# EAGLE design v11 (EAGLE 9.3.0)
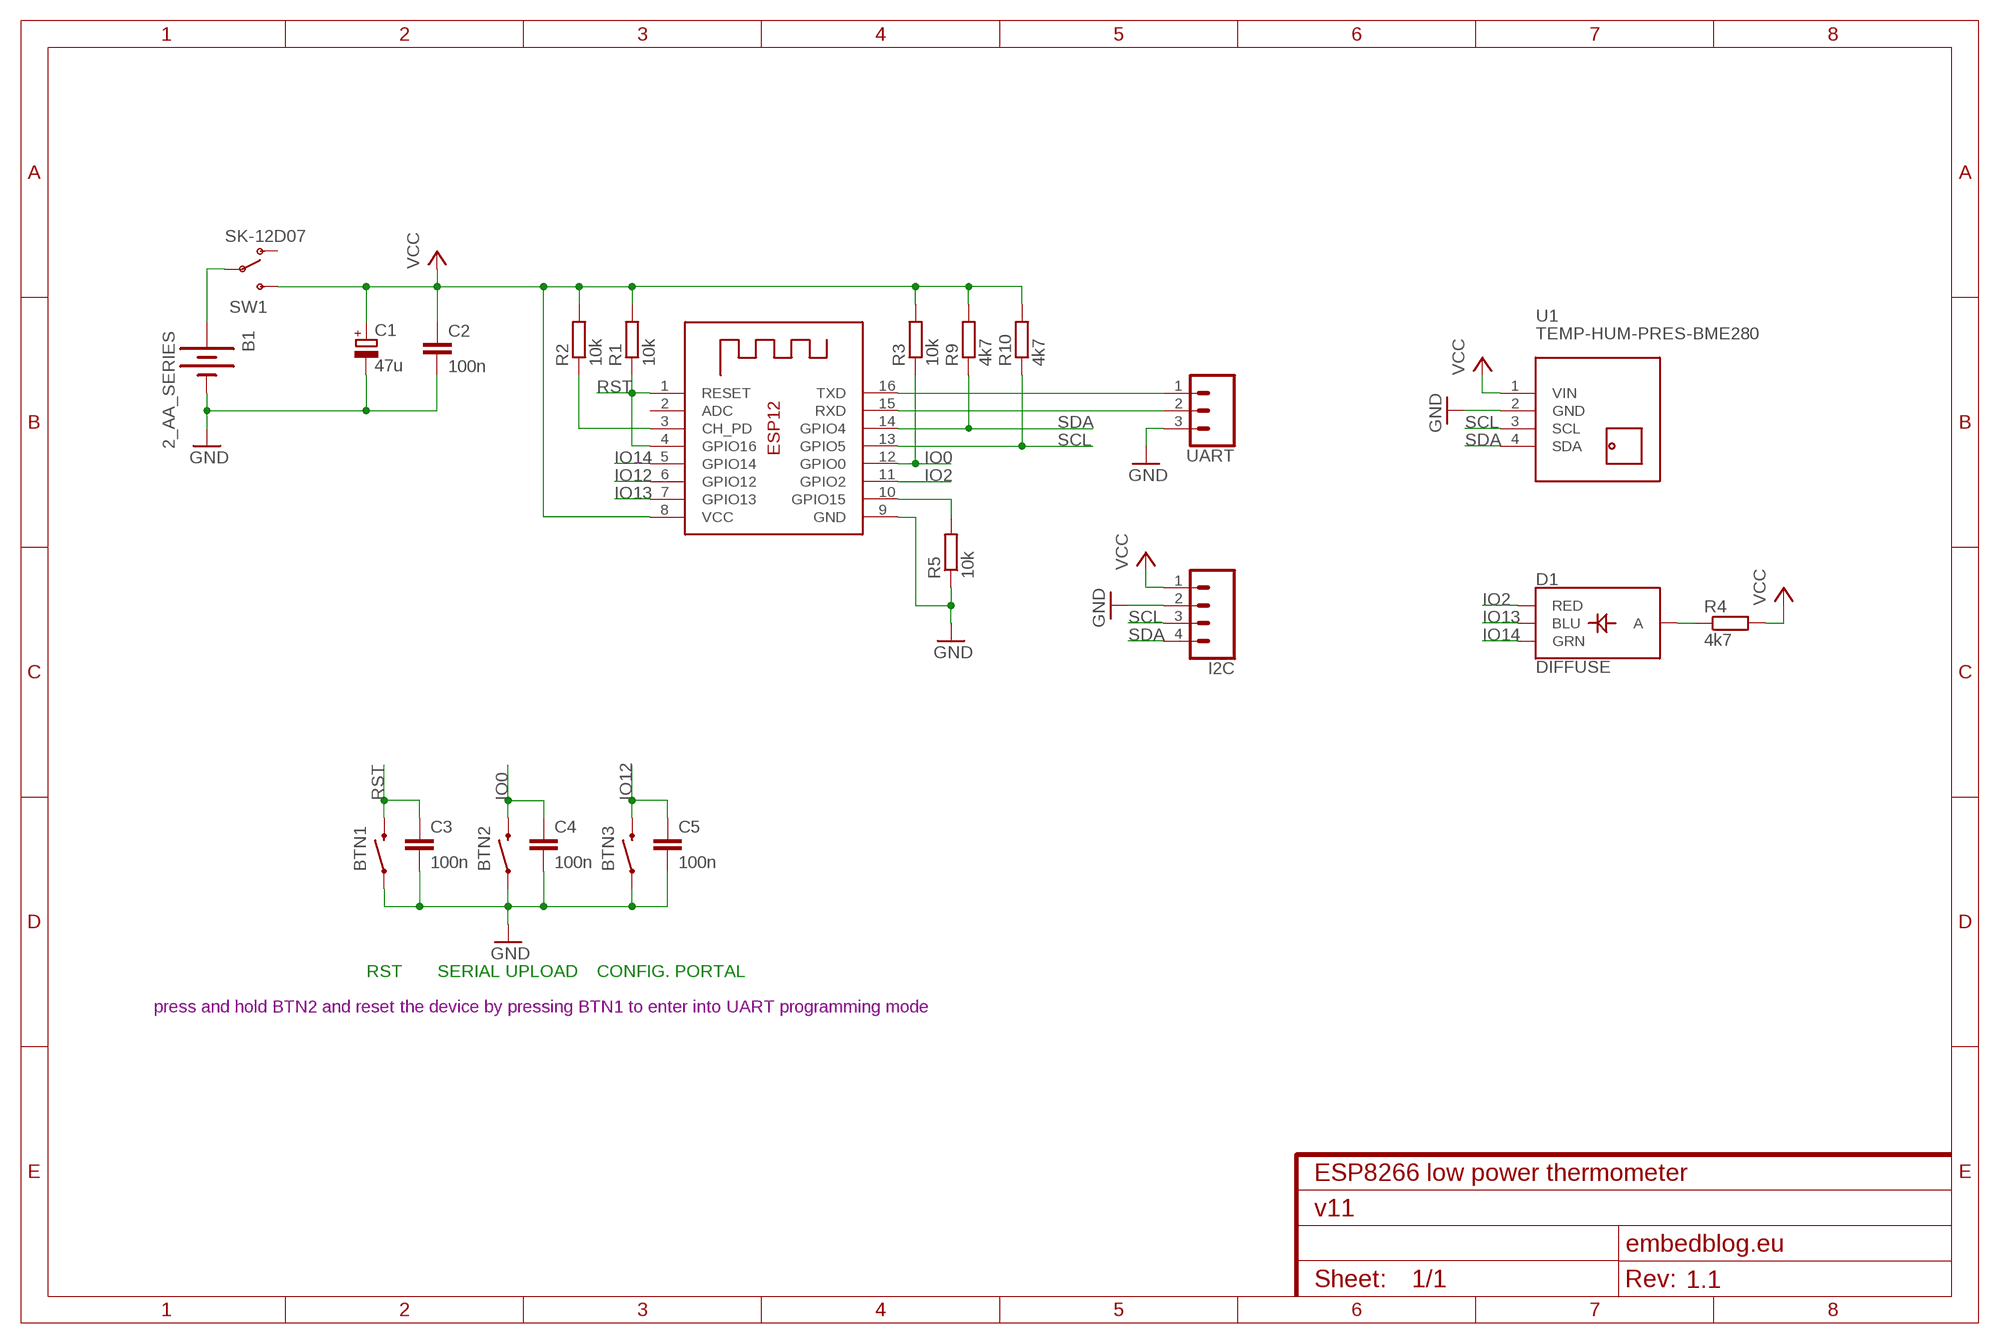
[diagram p0: schematic, sheet 1]
FRAME1 (FRAME-A4L): CNAME: ESP8266 low power thermometer; CREVISION: 1.1; DESIGNER: embedblog.eu; REV: 1.1

## Parts
B1  2_AA_SERIES  [AA_HOLDER_BH-321-1P]
BTN1  MOMENTARY-SWITCH-SPST-PTH-6.0MM  [TACTILE_SWITCH_PTH_6.0MM]
BTN2  MOMENTARY-SWITCH-SPST-PTH-6.0MM  [TACTILE_SWITCH_PTH_6.0MM]
BTN3  MOMENTARY-SWITCH-SPST-PTH-6.0MM  [TACTILE_SWITCH_PTH_6.0MM]
C1  47u  CPOL-EUSMCB  [SMC_B]
C2  100n  C-EUC1206  [C1206]
C3  100n  C-EUC1206  [C1206]
C4  100n  C-EUC1206  [C1206]
C5  100n  C-EUC1206  [C1206]
D1  DIFFUSE  LED-RGB-CADIFFUSE  [LED-RGB-THRU]
I2C  CONN_04  [1X04]
R1  10k  R-EU_R1206  [R1206]
R2  10k  R-EU_R1206  [R1206]
R3  10k  R-EU_R1206  [R1206]
R4  4k7  R-EU_R1206  [R1206]
R5  10k  R-EU_R1206  [R1206]
R9  4k7  R-EU_R1206  [R1206]
R10  4k7  R-EU_R1206  [R1206]
SW1  SK-12D07  [SK12SWITCH]
U1  TEMP-HUM-PRES-BME280  [TEMP-HUM-PRES-BME280]
UART  455-1750-1-ND  CONN_03  [1X03]
X1  ESP-12  [ESP-12]

## Nets
GND: B1.NEG(-) BTN1.1 BTN2.1 BTN3.1 C1.- C2.2 C3.2 C4.2 C5.2 I2C.2 R5.1 U1.2(GND) UART.3 X1.9(GND)
IO0: BTN2.3 C4.1 R3.1 X1.12(GPIO0)
IO2: D1.1(RED) X1.11(GPIO2)
IO12: BTN3.3 C5.1 X1.6(GPIO12)
IO13: D1.4(BLU) X1.7(GPIO13)
IO14: D1.3(GRN) X1.5(GPIO14)
N$1: D1.2(A) R4.1
N$2: R2.1 X1.3(CH_PD)
N$6: R5.2 X1.10(GPIO15)
N$8: B1.POS(+) SW1.P2(P)
RST: BTN1.3 C3.1 R1.1 X1.1(RESET) X1.4(GPIO16)
RX: UART.2 X1.15(RXD)
SCL: I2C.3 R10.1 U1.3(SCL) X1.13(GPIO5)
SDA: I2C.4 R9.1 U1.4(SDA) X1.14(GPIO4)
TX: UART.1 X1.16(TXD)
VCC: C1.+ C2.1 I2C.1 R1.2 R2.2 R3.2 R4.2 R9.2 R10.2 SW1.IN(S) U1.1(VIN) X1.8(VCC)
Unconnected: SW1.P1(O) X1.2(ADC)

## Notes on the sheet
- RST | SERIAL UPLOAD | CONFIG. PORTAL
- press and hold BTN2 and reset the device by pressing BTN1 to enter into UART programming mode

## Library data of the parts
B1 = custom:2_AA_SERIES
BTN1-BTN3 = SparkFun-Switches:MOMENTARY-SWITCH-SPST: Momentary Switch (Pushbutton) - SPST Normally-open (NO) SPST momentary switches (buttons, pushbuttons). Variants PTH-12MM - 12mm square, through-hole Momentary Pushbutton Switch - 12mm Square <https://www.sparkfun.com/products/9190> (COM-09190) PTH-6.0MM, PTH-6.0MM-KIT - 6.0mm square, through-hole Mini Pushbutton Switch <https://www.sparkfun.com/products/97> (COM-00097) KIT package intended for soldering kit's - only one side of pads' copper is exposed. PTH-RIGHT-ANGLE-KIT - Right-angle, through-hole Right Angle Tactile Button <https://www.sparkfun.com/products/10791> - Used on SparkFun BigTime Watch Kit <https://www.sparkfun.com/products/11734> SMD-12MM - 12mm square, surface-mount Tactile Button - SMD (12mm) <https://www.sparkfun.com/products/12993> (COM-12993) Used on SparkFun PicoBoard <https://www.sparkfun.com/products/11888> SMD-4.5MM - 4.5mm Square Trackball Switch Used on SparkFun Blackberry Trackballer Breakout <https://www.sparkfun.com/products/13169> SMD-4.6MMX2.8MM - 4.60mm x 2.80mm, surface mount Used on SparkFun SAMD21 Mini Breakout <https://www.sparkfun.com/products/13664> SMD-5.2MM, SMD-5.2-REDUNDANT - 5.2mm square, surface-mount Mini Pushbutton Switch - SMD <https://www.sparkfun.com/products/8720> (COM-08720) Used on Arduino Pro Mini <https://www.sparkfun.com/products/11114> REDUNDANT package connects both switch circuits together SMD-6.0X3.5MM - 6.0 x 3.5mm, surface mount Momentary Reset Switch SMD <https://www.sparkfun.com/products/8229> (COM-08229) SMD-6.2MM-TALL - 6.2mm square, surface mount Tactile Button - SMD (6mm) <https://www.sparkfun.com/products/12992> Used on SparkFun Digital Sandbox <https://www.sparkfun.com/products/12651> SMD-RIGHT-ANGLE - Right-angle, surface mount Used on SparkFun Block for Intel® Edison - Arduino <https://www.sparkfun.com/products/13036>; PROD_ID: SWCH-08441; SF_SKU: COM-00097
C1 = resistor:CPOL-EU: POLARIZED CAPACITOR, European symbol
C2-C5 = resistor:C-EU: CAPACITOR, European symbol
D1 = SparkFun-LED:LED-RGB-CA: LED-RGB Diffused Common Anode Packages: LED RGB-THRU P-LCC-4-3 LED-TRICOLOR-SMD SparkFun Products: RGB Diffused Common Anode- Diffuse <[https://www.sparkfun.com/products/10821]> RGB Diffused Common Anode - Clear <[https://www.sparkfun.com/products/10820]> Qduino Mini <[https://www.sparkfun.com/products/13614]> Triple Output LED RGB - SMD <https://www.sparkfun.com/products/7844>; PROD_ID: DIO-10632
I2C = SparkFun-Connectors:CONN_04: Multi connection point. Often used as Generic Header-pin footprint for 0.1 inch spaced/style header connections On any of the 0.1 inch spaced packages, you can populate with these: Break Away Headers - Straight <https://www.sparkfun.com/products/116> (PRT-00116) Break Away Male Headers - Right Angle <https://www.sparkfun.com/products/553> (PRT-00553) Female Headers <https://www.sparkfun.com/products/115> (PRT-00115) Break Away Headers - Machine Pin <https://www.sparkfun.com/products/117> (PRT-00117) Break Away Female Headers - Swiss Machine Pin <https://www.sparkfun.com/products/743> (PRT-00743) For SCREWTERMINALS and SPRING TERMINALS visit here: Screw Terimnals on SparkFun.com <https://www.sparkfun.com/search/results?term=Screw+Terminals> (5mm/3.5mm/2.54mm spacing) This device is also useful as a general connection point to wire up your design to another part of your project. Our various solder wires solder well into these plated through hole pads. Hook-Up Wire - Assortment (Stranded, 22 AWG) <https://www.sparkfun.com/products/11375> (PRT-11375) Hook-Up Wire - Assortment (Solid Core, 22 AWG) <https://www.sparkfun.com/products/11367> (PRT-11367) View the entire wire category on our website here <https://www.sparkfun.com/categories/141> Special notes: Molex polarized connector foot print use with SKU : PRT-08231 with associated crimp pins and housings. 1MM SMD Version SKU: PRT-10208; PROD_ID: CONN-09696
R1-R5 R9 R10 = resistor:R-EU_: RESISTOR, European symbol
SW1 = custom:SK-12D07
U1 = diy-modules:TEMP-HUM-PRES-BME280: Digital Humidity-Temperature-Pressure Sensor based on BME280 device More information about BME280 device is available here: https://www.bosch-sensortec.com/bst/products/all_products/bme280 Click here to find device on ebay.com <http://www.ebay.com/sch/bme280+breakout>
UART = SparkFun-Connectors:CONN_03: Multi connection point. Often used as Generic Header-pin footprint for 0.1 inch spaced/style header connections On any of the 0.1 inch spaced packages, you can populate with these: Break Away Headers - Straight <https://www.sparkfun.com/products/116> (PRT-00116) Break Away Male Headers - Right Angle <https://www.sparkfun.com/products/553> (PRT-00553) Female Headers <https://www.sparkfun.com/products/115> (PRT-00115) Break Away Headers - Machine Pin <https://www.sparkfun.com/products/117> (PRT-00117) Break Away Female Headers - Swiss Machine Pin <https://www.sparkfun.com/products/743> (PRT-00743) Stackable Header - 3 Pin (Female, 0.1") <https://www.sparkfun.com/products/13875> (PRT-13875) For SCREWTERMINALS and SPRING TERMINALS visit here: Screw Terimnals on SparkFun.com <https://www.sparkfun.com/search/results?term=Screw+Terminals> (5mm/3.5mm/2.54mm spacing) This device is also useful as a general connection point to wire up your design to another part of your project. Our various solder wires solder well into these plated through hole pads. Hook-Up Wire - Assortment (Stranded, 22 AWG) <https://www.sparkfun.com/products/11375> (PRT-11375) Hook-Up Wire - Assortment (Solid Core, 22 AWG) <https://www.sparkfun.com/products/11367> (PRT-11367) View the entire wire category on our website here <https://www.sparkfun.com/categories/141> Special notes: Molex polarized connector foot print use with SKU : PRT-08232 with associated crimp pins and housings.; PROD_ID: XXX-00000
X1 = adafruit:ESP-12

## Board
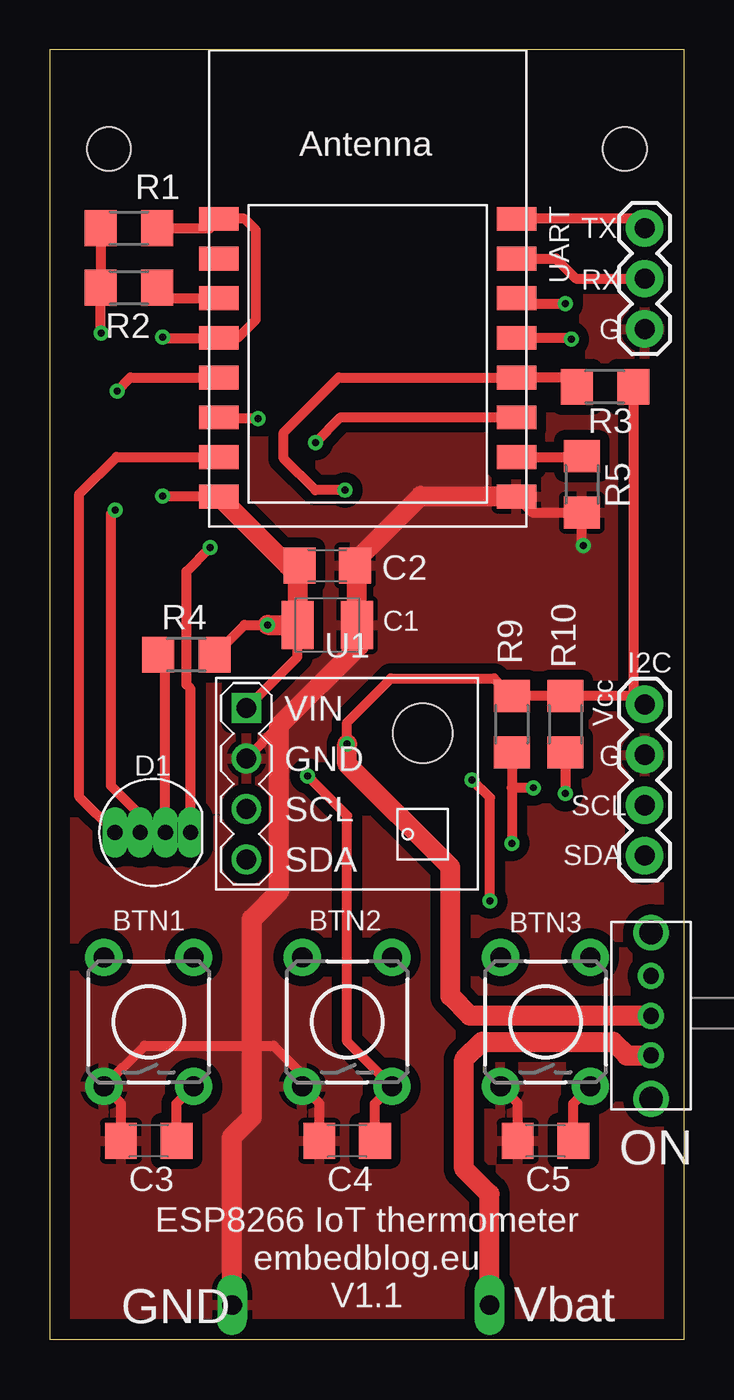
[diagram p1: board, top side]
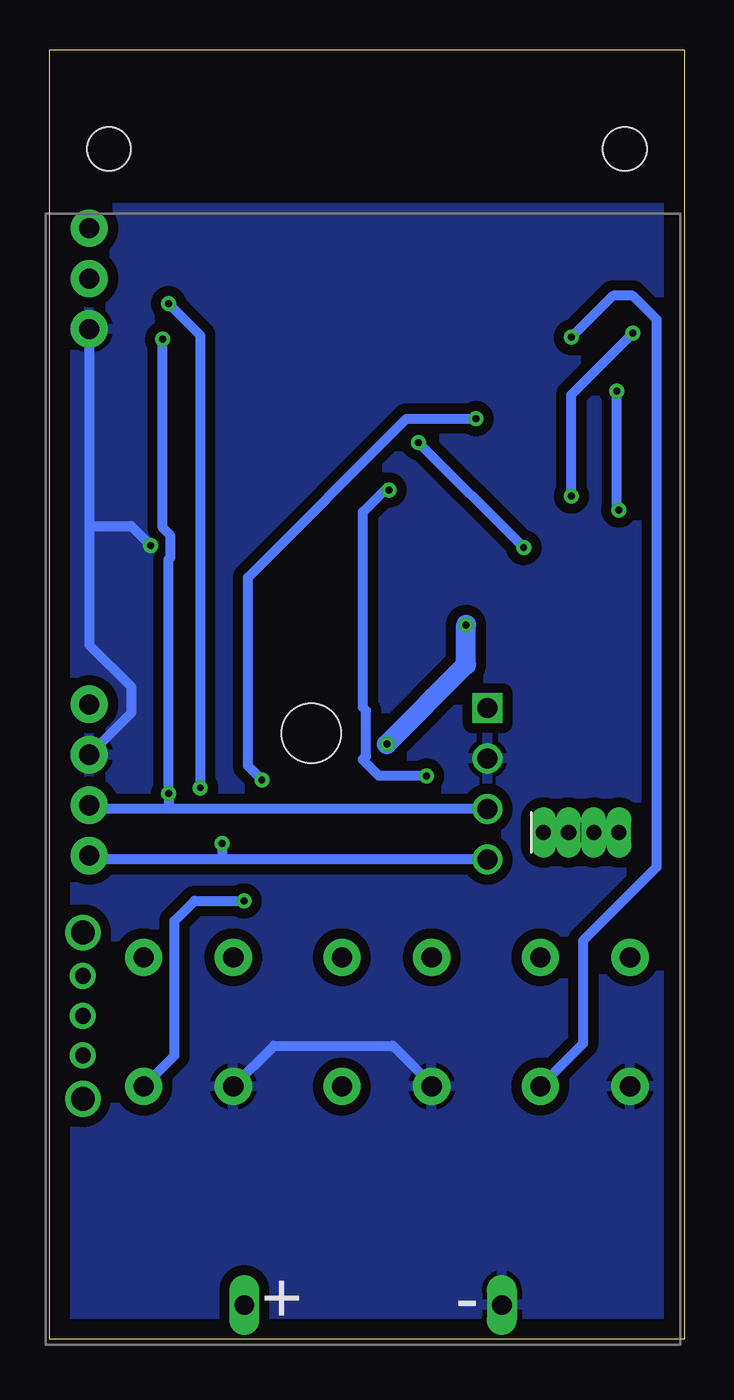
[diagram p2: board, bottom side, seen from below]

Size 32 x 65 mm. Coordinates in mm from the lower left corner, seen from the top.
Outline: 0,0 32,0 32,65 0,65 0,0
Copper layers (1*16): Top 0.035mm / dielectric 1.5mm / Bottom 0.035mm
Design rules "default": minimum track width 6mil, minimum drill 0.35mm, track to track 6mil, track to pad 6mil, pad to pad 6mil, via to via 6mil, smd to smd 6mil, copper to edge 40mil, drill to drill 6mil, minimum pad ring 10mil, minimum via ring 8mil, stop-mask expansion 4mil, vias tented up to drill 0mil, thermal gap 10mil
Holes 2.2 mm at 3,60 29,60

### Footprints (pad centres in the part's own frame; a part is rotated, then mirrored left to right if it is on the bottom)
AA_HOLDER_BH-321-1P = drill 1 long: NEG 9,55; POS 21.984,55
TACTILE_SWITCH_PTH_6.0MM = drill 1.016 pad 1.88: 1 -3.251,2.261; 2 3.251,2.261; 3 -3.251,-2.261; 4 3.251,-2.261
SMC_B = smd 1.6 x 2.4: + -1.5,0; - 1.5,0
C1206 = smd 1.6 x 1.8: 1 -1.4,0; 2 1.4,0
LED-RGB-THRU = drill 0.762 pad 0.813 long: 1 1.905,0; 2 0.635,0; 3 -0.635,0; 4 -1.905,0
1X04 = drill 1.016 pad 1.88: 1 0,0; 2 2.54,0; 3 5.08,0; 4 7.62,0
R1206 = smd 1.6 x 1.803: 1 -1.422,0; 2 1.422,0
SK12SWITCH = drill 0.8: IN 0,0; P1 0,2; P2 0,-2 | drill 1.2: PIN1 0,4.191; PIN2 0,-4.191
TEMP-HUM-PRES-BME280 = drill 1 square: 1 -5.08,3.81 | drill 1: 2 -5.08,1.27; 3 -5.08,-1.27; 4 -5.08,-3.81 | hole 3: 3.81,2.54
1X03 = drill 1.016 pad 1.88: 1 0,0; 2 2.54,0; 3 5.08,0
ESP-12 = smd 2 x 1.2: 1 -7.5,4.5; 2 -7.5,2.5; 3 -7.5,0.5; 4 -7.5,-1.5; 5 -7.5,-3.5; 6 -7.5,-5.5; 7 -7.5,-7.5; 8 -7.5,-9.5; 9 7.5,-9.5; 10 7.5,-7.5; 11 7.5,-5.5; 12 7.5,-3.5; 13 7.5,-1.5; 14 7.5,0.5; 15 7.5,2.5; 16 7.5,4.5

### Placement (x,y rotation side)
B1  0.2,56.73 180 bottom
BTN1  5,16 90 top
BTN2  15,16 90 top
BTN3  25,16 90 top
C1  14,36 0 top
C2  14,39 0 top
C3  5,10 180 top
C4  15,10 180 top
C5  25,10 180 top
D1  5.2,25.55 0 top
I2C  30,32 270 top
R1  4,56 180 top
R2  4,53 180 top
R3  28,48 0 top
R4  6.9,34.5 0 top
R5  26.83,43.09 90 top
R9  23.3,31 90 top
R10  26,31 90 top
SW1  30.32,16.31 0 top
U1  15,28 0 top
UART  30,56 270 top
X1  16.04,51.97 0 top

### Tracks (layer width: path | path; a pad name or v marks a point on that pad's centre or on a via)
GND  (via drill 0.35)
  Top 0.508: 15.6,35.9 C1.- | 23.33,42.32 23.51,42.5 | U1.2 11.57,30.92 | C3.2 3.6,11.89 BTN1.1 4.79,14.8 10.2,14.8 11.3,14.8 12.74,13.36 BTN2.1 13.6,11.89 C4.2 | C5.2 23.6,11.89 BTN3.1 | X1.9 24.34,41.67 R5.1 26.83,40.07 v26.9,40
  Top 1.016: C1.- 15.5,38.9 C2.2 15.4,39.2 18.7,42.5 23.51,42.5 X1.9 | 15.6,35.9 15.6,34.95 11.57,30.92 11.57,22.58 10.2,21.2 10.2,14.8 10.2,11.2 9.2,10.2 B1.NEG
  Bottom 0.508: UART.3 30,41 | 30,41 30,35 27.9,32.9 27.9,31.56 I2C.2 | 30,41 27.9,41 v26.9,40 | BTN3.1 20.69,14.8 14.7,14.8 12.74,12.84 BTN2.1
  pour Top (isolate 0.508): 0,0 32,0 32,57 0,57
  pour Bottom (isolate 0.508): 0,57 32,57 32,0 0,0
IO0  (via drill 0.35)
  Top 0.508: R3.1 26.11,48.47 X1.12 14.57,48.47 11.8,45.7 11.8,44.4 13.4,42.8 v14.9,42.8 | C4.1 16.4,11.89 BTN2.3 15,15.01 15,26.4 v13,28.4
  Bottom 0.508: v13,28.4 15.4,28.4 16.2,29.2 16.2,29.23 16.04,29.39 16.04,31.69 16.2,31.85 16.2,41.7 15.1,42.8 v14.9,42.8
IO2  (via drill 0.35)
  Top 0.508: v13.4,45.2 14.67,46.47 X1.11 | D1.1 7.11,32.8 6.9,33 6.9,38.7 v8.1,39.9
  Bottom 0.508: v8.1,39.9 v13.4,45.2
IO12  (via drill 0.35)
  Top 0.508: C5.1 26.4,11.89 BTN3.3 | v22.2,22.1 22.2,27.3 v21.3,28.2 | v10.5,46.4 8.61,46.4 X1.6
  Bottom 0.508: BTN3.3 25.7,14.31 25.7,21.1 24.7,22.1 v22.2,22.1 | v21.3,28.2 22,28.9 22,38.4 14,46.4 v10.5,46.4
IO13
  Top 0.508: D1.4 1.5,27.34 1.5,42.6 3.37,44.47 X1.7
IO14  (via drill 0.35)
  Top 0.508: D1.3 4.57,26.44 3.1,27.9 3.1,41.6 v3.3,41.8 | v3.4,47.8 4.07,48.47 X1.5
  Bottom 0.508: v3.3,41.8 3.4,41.9 v3.4,47.8
N$1
  Top 0.508: D1.2 5.83,34.14 R4.1
N$2
  Top 0.508: R2.1 5.95,52.47 X1.3
N$6
  Top 0.508: X1.10 26.79,44.47 R5.2
N$8
  Top 1.016: SW1.P2 29.11,14.31 29.1,14.3 28.4,15 21.8,15 20.9,14.1 20.9,8.6 22.18,7.32 B1.POS
RST  (via drill 0.35)
  Top 0.508: R1.1 8.07,56 X1.1 9.83,56.47 10.4,55.9 10.4,51.4 9.47,50.47 8.7,50.47 X1.4 5.73,50.47 v5.7,50.5 | C3.1 6.4,11.89 BTN1.3
  Bottom 0.508: BTN1.3 5.1,14.91 5.1,20.1 1.4,23.8 1.4,51.4 2.6,52.6 3.6,52.6 v5.7,50.5
RX
  Top 0.508: X1.15 25.53,54.47 26.54,53.46 UART.2
SCL  (via drill 0.35)
  Top 0.508: R10.1 v26,27.5 | v26.3,50.4 26.23,50.47 X1.13
  Bottom 0.508: U1.3 26,26.73 | 26,26.73 29.81,26.73 I2C.3 | 26,26.73 v26,27.5 26,39.3 25.9,39.4 25.9,40.5 26.3,40.9 v26.3,50.4
SDA  (via drill 0.35)
  Top 0.508: R9.1 23.3,27.8 | 23.3,27.8 v23.3,25 | X1.14 23.81,52.2 v26,52.2 | v24.4,27.8 23.3,27.8
  Bottom 0.508: U1.4 23.4,24.19 | 23.4,24.19 29.81,24.19 I2C.4 | v23.3,25 23.3,24.29 23.4,24.19 | v26,52.2 24.4,50.6 v24.4,27.8
TX
  Top 0.508: UART.1 29.53,56.47 X1.16
VCC  (via drill 0.35)
  Top 0.508: R1.2 R2.2 2.58,50.72 v2.6,50.7 | U1.1 12.5,34.39 C1.+ | X1.8 5.73,42.47 v5.7,42.5 | R3.2 29.42,32.58 I2C.1 29.58,32.42 R10.2 R9.2 22.41,33.31 17.21,33.31 15,31.1 v15,30 | R4.2 9.82,36 v11,36
  Top 1.016: X1.8 12.01,39 C2.1 12.5,38.9 C1.+ v11,36 | SW1.IN 21.19,16.31 20.2,17.3 20.2,23.8 15,29 v15,30
  Bottom 0.508: v5.7,42.5 5.7,47.6 v2.6,50.7
  Bottom 1.016: v15,30 11,34 v11,36

### Text on the board
tNames: TX | RX | G | Vcc | G | SCL | SDA | ON | ESP8266 IoT thermometer / embedblog.eu / V1.1 | GND | Vbat